# Altium schematic sheet Thumbstick.SchDoc: Thumbstick
size 431 x 279 mm; Author: Changran Liu / Kaiwen Zhou; CompanyName: Upenn; DrawnBy: Changran Liu / Kaiwen Zhou; Engineer: Changran Liu / Kaiwen Zhou; Organization: Upenn; DocumentNumber: 8; SheetNumber: 7; SheetTotal: 9
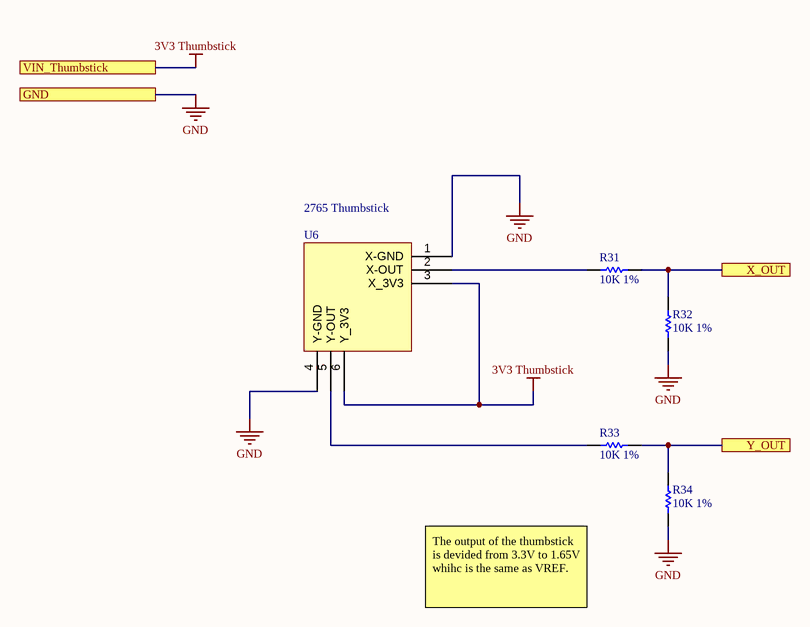
[diagram p0: Thumbstick.SchDoc]

## Parts
R31  10K 1%  [RESC0603(1608)_N]
R32  10K 1%  [RESC0603(1608)_N]
R33  10K 1%  [RESC0603(1608)_N]
R34  10K 1%  [RESC0603(1608)_N]
U6  2765 Thumbstick  [thumbstick]

## Ports
GND, VIN_Thumbstick, X_OUT, Y_OUT

## Nets
3V3 Thumbstick: U6.3(X_3V3) U6.6(Y_3V3) ; port VIN_Thumbstick
GND: R32.1 R34.1 U6.1(X-GND) U6.4(Y-GND) ; port GND
X_OUT: R31.1 R32.2 ; port X_OUT
Y_OUT: R33.1 R34.2 ; port Y_OUT
NetR31_2: R31.2 U6.2(X-OUT)
NetR33_2: R33.2 U6.5(Y-OUT)

## Notes on the sheet
- The output of the thumbstick is devided from 3.3V to 1.65V whihc is the same as VREF.
- DWG. NO.
- REV.
- SHT.
- THIS DOCUMENT AND THE DATA DISCLOSED HEREIN OR HEREWITH IS THE PROPERTY OF ALTIUM LIMITED AND MAY BE FREELY DISTRIBUTED IN WHOLE. NO RIGHTS ARE RESERVED OR EXPRESS OR IMPLIED WARANTEE GIVEN.
- REVISION
- DESCRIPTION
- DATE
- APPROVED
- ENG:
- APPROVALS
- PROJECT
- DSN:
- CHK:
- REFERENCE DOCUMENTS
- PROJECT REVISION:
- TITLE
- DOCUMENT REVISION:
- DESIGN ITEM:
- BOM:
- FAB DWG:
- PCB DWG:
- ASSY DWG:
- SCALE:
- SIZE
- B
- CAGE CODE
- FILE NAME
- DWG NO.
- SHEET
- OF
- REV

## Library data of the parts
R31-R34 = CMP-1012-00623-1: 10K 0.1W 1% 0603 (1608 Metric)  SMD; Value: 10000.00 Ohm; Case-EIA: 0603; Case-Metric: 1608; Power: 0.1 W; Tolerance: 1 %; Technology: SMT
U6 = 2765 Thumbstick: JOYSTICK 10K OHM 2 AXIS TH; Manufacturer: Adafruit Industries; Manufacturer Part Number: 2765; Resistance: 10kR; Supplier 1: Digi-Key; Supplier Part Number 1: 1528-1730-ND; RoHS: Yes; Stock 1: 17; Pricing 1: 1=2.50000 (USD); Mount: Through Hole; Packaging: Bulk; Length: 0.707inch; Width: 0.697inch; Height: 0.472inch; ComponentLink1URL: https://media.digikey.com/pdf/Data%20Sheets/Adafruit%20PDFs/2765_Web.pdf?src-supplier=Digi-Key; ComponentLink1Description: https://media.digikey.com/pdf/Data%20Sheets/Adafruit%20PDFs/2765_Web.pdf?src-supplier=Digi-Key